# EAGLE schematic Sensor_Ada (EAGLE 8.4.1)
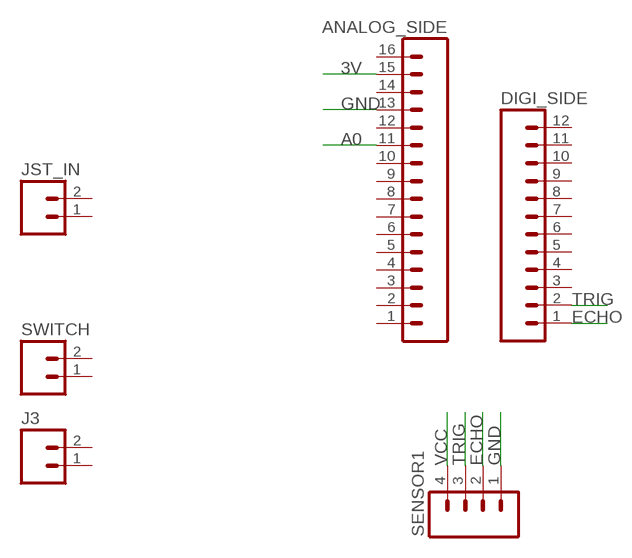
[diagram p0: schematic, sheet 1]

## Parts
ANALOG_SIDE  M16LOCK  [1X16_LOCK]
DIGI_SIDE  M12LOCK  [1X12_LOCK]
J3  M02LOCK  [1X02_LOCK]
JST_IN  M02JST-PTH-VERT  [JST-2-PTH-VERT]
SENSOR1  M04LOCK  [1X04_LOCK]
SWITCH  M02LOCK  [1X02_LOCK]

## Nets
3V: ANALOG_SIDE.15
A0: ANALOG_SIDE.11
ECHO: DIGI_SIDE.1 SENSOR1.2
GND: ANALOG_SIDE.13 SENSOR1.1
TRIG: DIGI_SIDE.2 SENSOR1.3
VCC: SENSOR1.4
Unconnected: ANALOG_SIDE.1 ANALOG_SIDE.2 ANALOG_SIDE.3 ANALOG_SIDE.4 ANALOG_SIDE.5 ANALOG_SIDE.6 ANALOG_SIDE.7 ANALOG_SIDE.8 ANALOG_SIDE.9 ANALOG_SIDE.10 ANALOG_SIDE.12 ANALOG_SIDE.14 ANALOG_SIDE.16 DIGI_SIDE.3 DIGI_SIDE.4 DIGI_SIDE.5 DIGI_SIDE.6 DIGI_SIDE.7 DIGI_SIDE.8 DIGI_SIDE.9 DIGI_SIDE.10 DIGI_SIDE.11 DIGI_SIDE.12 J3.1 J3.2 JST_IN.1 JST_IN.2 SWITCH.1 SWITCH.2

## Library data of the parts
ANALOG_SIDE = SparkFun-Connectors:M16: 1x16 .1" header
DIGI_SIDE = SparkFun-Connectors:M12: Header 12 Standard 12-pin 0.1" header. Use with straight break away headers (SKU : PRT-00116), right angle break away headers (PRT-00553), swiss pins (PRT-00743), machine pins (PRT-00117), and female headers (PRT-00115).
J3 JST_IN SWITCH = SparkFun-Connectors:M02: Standard 2-pin 0.1" header. Use with - straight break away headers ( PRT-00116) - right angle break away headers (PRT-00553) - swiss pins (PRT-00743) - machine pins (PRT-00117) - female headers (PRT-00115) Molex polarized connector foot print use with: PRT-08233 with associated crimp pins and housings. 2.54_SCREWTERM for use with PRT-10571. 3.5mm Screw Terminal footprints for PRT-08084 5mm Screw Terminal footprints for use with PRT-08432
SENSOR1 = SparkFun-Connectors:M04: Header 4 Standard 4-pin 0.1" header. Use with straight break away headers (SKU : PRT-00116), right angle break away headers (PRT-00553), swiss pins (PRT-00743), machine pins (PRT-00117), and female headers (PRT-00115). Molex polarized connector foot print use with SKU : PRT-08231 with associated crimp pins and housings. 1MM SMD Version SKU: PRT-10208; PROD_ID: CONN-09696